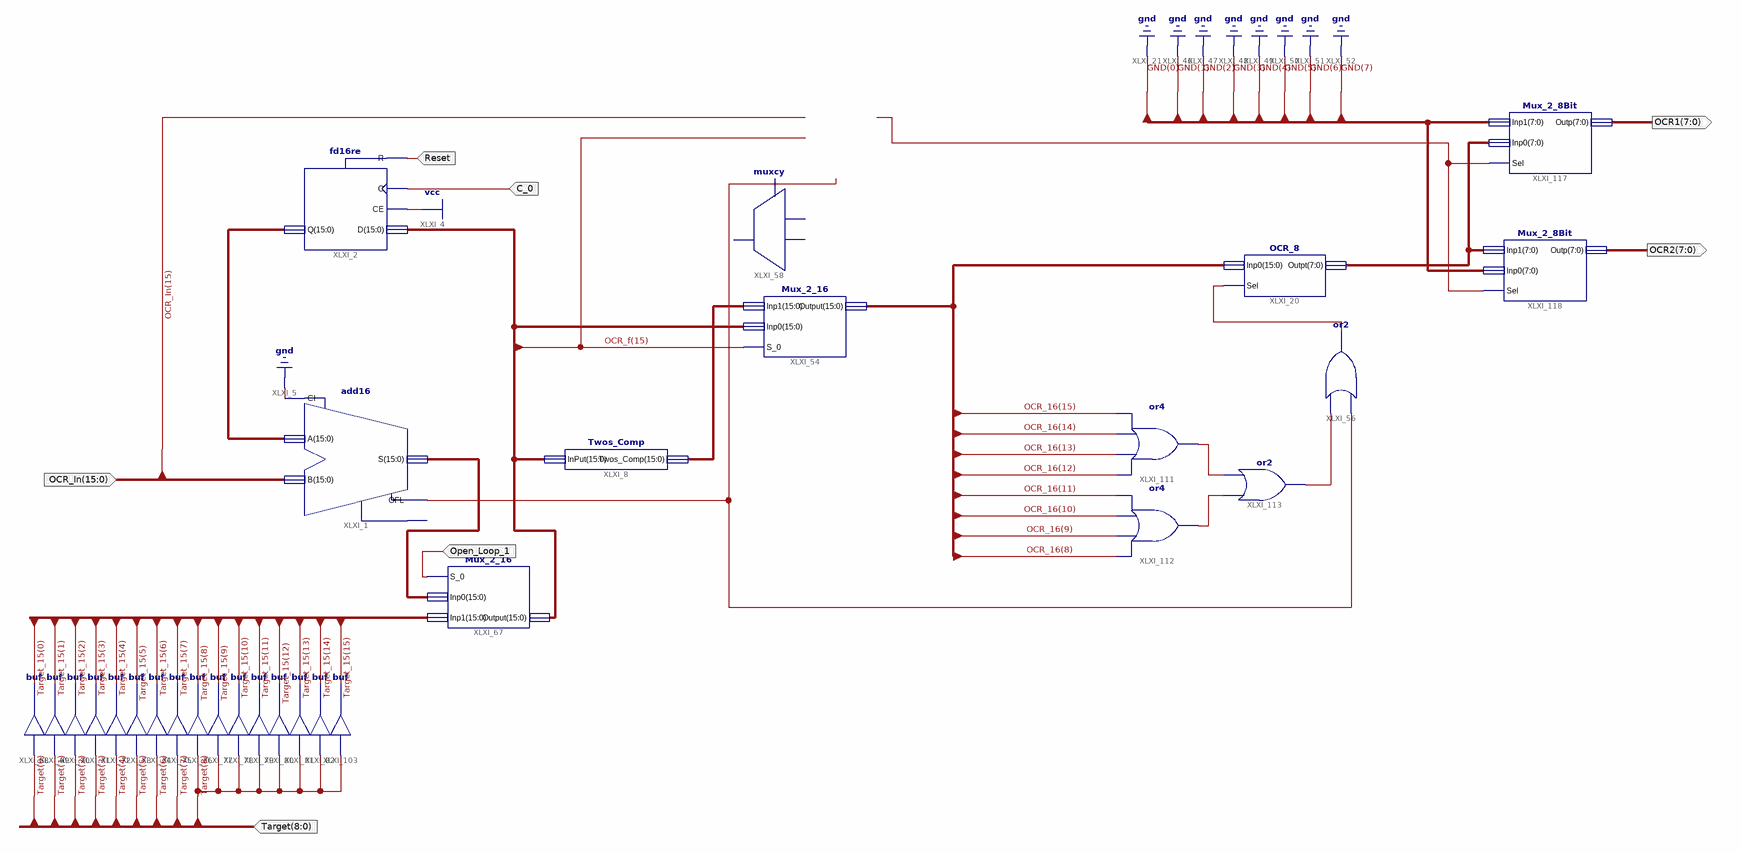
[diagram p0: schematic sheet 1]
// Xilinx ISE schematic OCR_Generator.sch (spartan3e) as structural Verilog: 29 symbols, 7 ports
module OCR_Generator (
  input  C_0,
  input  [15:0] OCR_In,
  input  [8:0] Target,
  input  Open_Loop_1,
  input  Reset,
  output [7:0] OCR2,
  output [7:0] OCR1
);

  wire XLXN_16, XLXN_18, XLXN_19, XLXN_20, XLXN_27, XLXN_28;
  wire [7:0] XLXN_15;
  wire [15:0] OCR_16, OCR_Curr, OCR_f, OCR_Twos, Target_15, XLXN_3;

  add16 XLXI_1 (.A(XLXN_3), .B(OCR_In), .CI(1'b0), .OFL(XLXN_16), .S(OCR_Curr));  // open: CO
  fd16re XLXI_2 (.C(C_0), .CE(1'b1), .D(OCR_f), .R(Reset), .Q(XLXN_3));
  Twos_Comp XLXI_8 (.InPut(OCR_f), .Twos_Comp(OCR_Twos));
  Mux_2_16 XLXI_54 (.Inp1(OCR_Twos), .Inp0(OCR_f), .S_0(OCR_f[15]), .Output(OCR_16));
  muxcy XLXI_58 (.CI(OCR_In[15]), .DI(OCR_f[15]), .S(XLXN_16), .O(XLXN_20));
  buf XLXI_68 (Target_15[0], Target[0]);
  buf XLXI_69 (Target_15[1], Target[1]);
  buf XLXI_70 (Target_15[2], Target[2]);
  buf XLXI_71 (Target_15[3], Target[3]);
  buf XLXI_72 (Target_15[4], Target[4]);
  buf XLXI_73 (Target_15[5], Target[5]);
  buf XLXI_74 (Target_15[6], Target[6]);
  buf XLXI_75 (Target_15[7], Target[7]);
  buf XLXI_76 (Target_15[8], Target[8]);
  buf XLXI_77 (Target_15[9], Target[8]);
  buf XLXI_78 (Target_15[10], Target[8]);
  buf XLXI_79 (Target_15[11], Target[8]);
  buf XLXI_80 (Target_15[12], Target[8]);
  buf XLXI_81 (Target_15[13], Target[8]);
  buf XLXI_82 (Target_15[14], Target[8]);
  buf XLXI_103 (Target_15[15], Target[8]);
  or XLXI_56 (XLXN_19, XLXN_16, XLXN_18);
  or XLXI_111 (XLXN_27, OCR_16[12], OCR_16[13], OCR_16[14], OCR_16[15]);
  or XLXI_112 (XLXN_28, OCR_16[8], OCR_16[9], OCR_16[10], OCR_16[11]);
  or XLXI_113 (XLXN_18, XLXN_28, XLXN_27);
  Mux_2_16 XLXI_67 (.Inp1(Target_15), .Inp0(OCR_Curr), .S_0(Open_Loop_1), .Output(OCR_f));
  OCR_8 XLXI_20 (.Sel(XLXN_19), .Inp0(OCR_16), .Outpt(XLXN_15));
  Mux_2_8Bit XLXI_118 (.Inp1(XLXN_15), .Inp0({8{1'b0}}), .Sel(XLXN_20), .Outp(OCR2));
  Mux_2_8Bit XLXI_117 (.Inp1({8{1'b0}}), .Inp0(XLXN_15), .Sel(XLXN_20), .Outp(OCR1));
endmodule
